# EAGLE schematic MDB1986 (EAGLE 9.0.0)
Milandr Development Board K1986BE1T (K1986BE1QI - LQFP144)
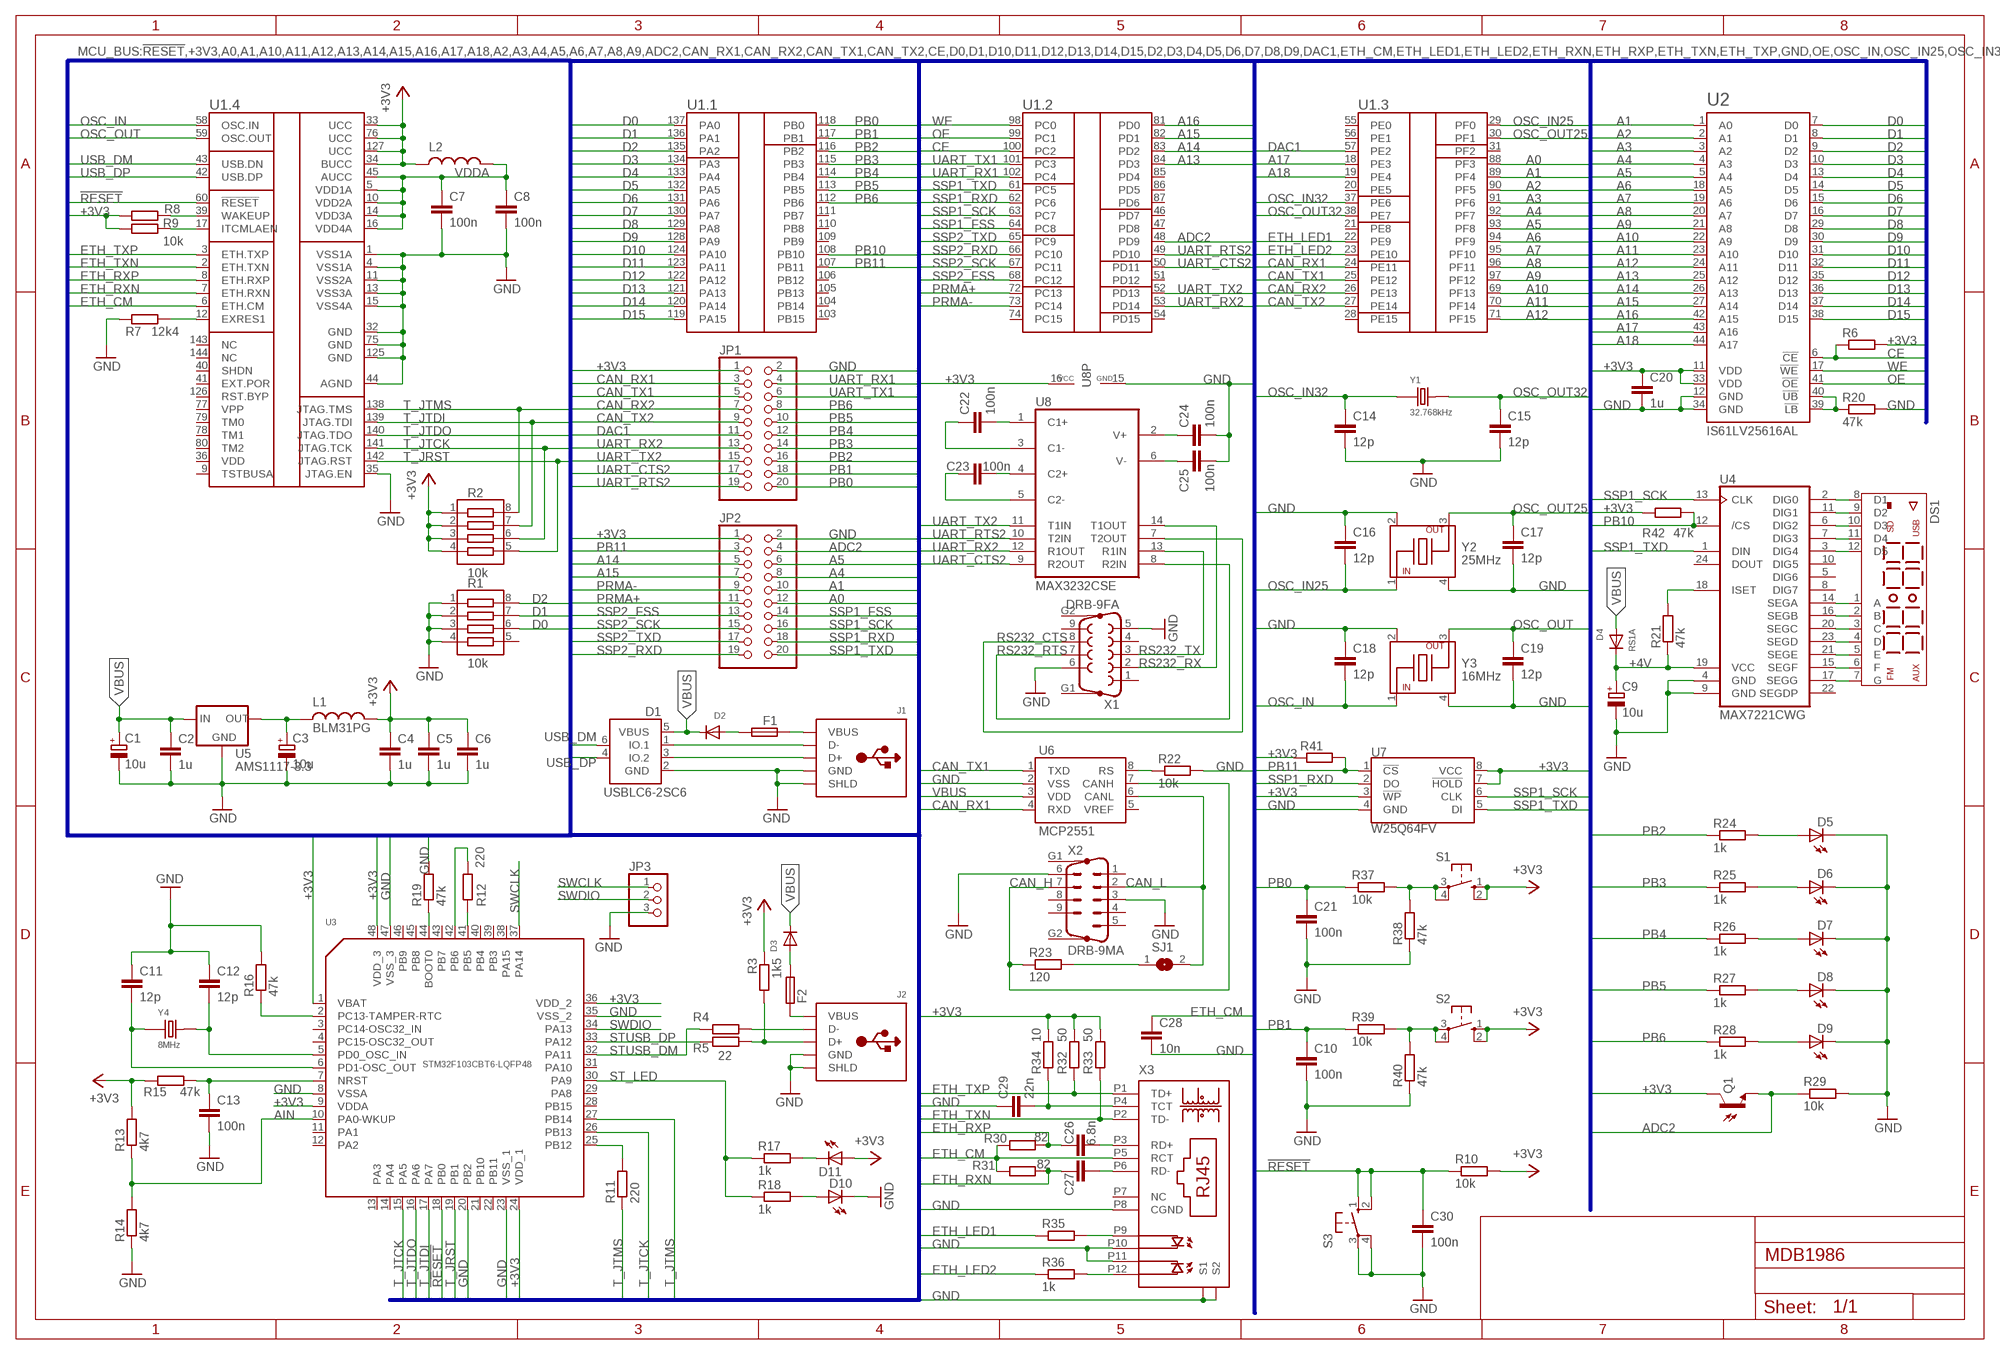
[diagram p0: schematic, sheet 1]

## Parts
C1  10u  CPOL-EU  [RCL-1206F-POL]
C2  1u  C-EU0805  [RCL-0805F]
C3  10u  CPOL-EU  [RCL-1206F-POL]
C4  1u  C-EU0805  [RCL-0805F]
C5  1u  C-EU0805  [RCL-0805F]
C6  1u  C-EU0805  [RCL-0805F]
C7  100n  C-EU0805  [RCL-0805F]
C8  100n  C-EU0805  [RCL-0805F]
C9  10u  CPOL-EU  [RCL-1206F-POL]
C10  100n  C-EU0805  [RCL-0805F]
C11  12p  C-EU0805  [RCL-0805F]
C12  12p  C-EU0805  [RCL-0805F]
C13  100n  C-EU0805  [RCL-0805F]
C14  12p  C-EU0805  [RCL-0805F]
C15  12p  C-EU0805  [RCL-0805F]
C16  12p  C-EU0805  [RCL-0805F]
C17  12p  C-EU0805  [RCL-0805F]
C18  12p  C-EU0805  [RCL-0805F]
C19  12p  C-EU0805  [RCL-0805F]
C20  1u  C-EU0805  [RCL-0805F]
C21  100n  C-EU0805  [RCL-0805F]
C22  100n  C-EU0805  [RCL-0805F]
C23  100n  C-EU0805  [RCL-0805F]
C24  100n  C-EU0805  [RCL-0805F]
C25  100n  C-EU0805  [RCL-0805F]
C26  6.8n  C-EU0805  [RCL-0805F]
C27  C-EU0805  [RCL-0805F]
C28  10n  C-EU0805  [RCL-0805F]
C29  22n  C-EU0805  [RCL-0805F]
C30  100n  C-EU0805  [RCL-0805F]
D1  USBLC6-2SC6  [SOT-23-6L]
D2  DIODEDO-214(SMB)  [DO-214AA(SMB)]
D3  DIODEDO-214(SMB)  [DO-214AA(SMB)]
D4  RS1A  DIODEDO-214(SMA)  [DO-214AC(SMA)]
D5  LED1206  [LED-1206F]
D6  LED1206  [LED-1206F]
D7  LED1206  [LED-1206F]
D8  LED1206  [LED-1206F]
D9  LED1206  [LED-1206F]
D10  LED1206  [LED-1206F]
D11  LED1206  [LED-1206F]
DS1  LED-7SEG-12PIN-CC  [LED-7SEG-12P2.54]
F1  FUSE-NSMF  [RCL-1206F]
F2  FUSE-NSMF  [RCL-1206F]
J1  USB-TYPE-B  [USB-TYPE-B-4P]
J2  USB-TYPE-B  [USB-TYPE-B-4P]
JP1  PINHD-2X10  [2X10]
JP2  PINHD-2X10  [2X10]
JP3  PINHD-1X3  [1X03]
L1  BLM31PG  L-EU1206  [RCL-1206F]
L2  L-EU1206  [RCL-1206F]
Q1  PHOTOTRANSISTORPT17-21C-L41-TR8  [PT17-21C-L41-TR8]
R1  10k  RA-CAT16-F4  [RA-1206-X4]
R2  10k  RA-CAT16-F4  [RA-1206-X4]
R3  1k5  R-EU0805  [RCL-0805F]
R4  R-EU0805  [RCL-0805F]
R5  22  R-EU0805  [RCL-0805F]
R6  R-EU0805  [RCL-0805F]
R7  12k4  R-EU0805  [RCL-0805F]
R8  R-EU0805  [RCL-0805F]
R9  10k  R-EU0805  [RCL-0805F]
R10  10k  R-EU0805  [RCL-0805F]
R11  220  R-EU0805  [RCL-0805F]
R12  220  R-EU0805  [RCL-0805F]
R13  4k7  R-EU0805  [RCL-0805F]
R14  4k7  R-EU0805  [RCL-0805F]
R15  47k  R-EU0805  [RCL-0805F]
R16  47k  R-EU0805  [RCL-0805F]
R17  1k  R-EU0805  [RCL-0805F]
R18  1k  R-EU0805  [RCL-0805F]
R19  47k  R-EU0805  [RCL-0805F]
R20  47k  R-EU0805  [RCL-0805F]
R21  47k  R-EU0805  [RCL-0805F]
R22  10k  R-EU0805  [RCL-0805F]
R23  120  R-EU0805  [RCL-0805F]
R24  1k  R-EU0805  [RCL-0805F]
R25  1k  R-EU0805  [RCL-0805F]
R26  1k  R-EU0805  [RCL-0805F]
R27  1k  R-EU0805  [RCL-0805F]
R28  1k  R-EU0805  [RCL-0805F]
R29  10k  R-EU0805  [RCL-0805F]
R30  82  R-EU0805  [RCL-0805F]
R31  82  R-EU0805  [RCL-0805F]
R32  50  R-EU0805  [RCL-0805F]
R33  50  R-EU0805  [RCL-0805F]
R34  10  R-EU0805  [RCL-0805F]
R35  R-EU0805  [RCL-0805F]
R36  1k  R-EU0805  [RCL-0805F]
R37  10k  R-EU0805  [RCL-0805F]
R38  47k  R-EU0805  [RCL-0805F]
R39  10k  R-EU0805  [RCL-0805F]
R40  47k  R-EU0805  [RCL-0805F]
R41  R-EU0805  [RCL-0805F]
R42  47k  R-EU0805  [RCL-0805F]
S1  SWITCH-10-XX  [BUTTON-B3F-10XX]
S2  SWITCH-10-XX  [BUTTON-B3F-10XX]
S3  SWITCH-10-XX  [BUTTON-B3F-10XX]
SJ1  SJ  [SJ]
U1  MCU-K1986BE1QI  [LQFP144-0.5-20X20M]
U2  IS61LV25616AL  [TSOP2-44-400BF]
U3  STM32F103CBT6-LQFP48  MCU-STM32F103CBT6  [LQFP48-0.5-7X7MM]
U4  MAX7221CWG  [SO24W]
U5  AMS1117-3.3  [SOT223]
U6  MCP2551  [SO08]
U7  W25Q64FV  W25Q64FVSS  [SOIC-8]
U8  MAX3232CSE  [SO16]
X1  DRB-9FA  F09HP  [F09HP]
X2  DRB-9MA  M09HP  [M09HP]
X3  HR911105A  [RJ45]
Y1  32.768kHz  CRYSTAL-FC-135  [XTAL-FC-135]
Y2  25MHz  CRYSTAL-FA-238  [XTAL-FA-238]
Y3  16MHz  CRYSTAL-FA-238  [XTAL-FA-238]
Y4  8MHz  CRYSTAL-NX3225  [XTAL-NX3225]

## Nets
!RESET: C30.1 R10.1 S3.1(S) S3.2(S1) U1.60(.4:!RESET) U3.18(PB0)
+3V3: C4.1 C5.1 C6.1 C20.1 D11.A JP1.1 JP2.1 L1.2 L2.1 Q1.C R2.1(P.1) R2.2(P.2) R2.3(P.3) R2.4(P.4) R3.1 R6.2 R8.1 R9.1 R10.2 R13.2 R15.1 R32.2 R33.2 R34.2 R41.1 R42.1 S1.1(S) S1.2(S1) S2.1(S) S2.2(S1) U1.33(.4:UCC) U1.34(.4:BUCC) U1.76(.4:UCC) U1.127(.4:UCC) U2.11(VDD) U2.33(VDD) U3.1(VBAT) U3.9(VDDA) U3.24(VDD_1) U3.36(VDD_2) U3.48(VDD_3) U7.3(!WP) U7.7(!HOLD) U7.8(VCC) U8.16(VCC)
+4V: C9.+ D4.C R21.1 U4.19(VCC)
A0: JP2.12 U1.88(.3:PF3)
A1: JP2.10 U1.89(.3:PF4) U2.1(A0)
A2: U1.90(.3:PF5) U2.2(A1)
A3: U1.91(.3:PF6) U2.3(A2)
A4: JP2.8 U1.92(.3:PF7) U2.4(A3)
A5: JP2.6 U1.93(.3:PF8) U2.5(A4)
A6: U1.94(.3:PF9) U2.18(A5)
A7: U1.95(.3:PF10) U2.19(A6)
A8: U1.96(.3:PF11) U2.20(A7)
A9: U1.97(.3:PF12) U2.21(A8)
A10: U1.69(.3:PF13) U2.22(A9)
A11: U1.70(.3:PF14) U2.23(A10)
A12: U1.71(.3:PF15) U2.24(A11)
A13: U1.84(.2:PD3) U2.25(A12)
A14: JP2.5 U1.83(.2:PD2) U2.26(A13)
A15: JP2.7 U1.82(.2:PD1) U2.27(A14)
A16: U1.81(.2:PD0) U2.42(A15)
A17: U1.18(.3:PE3) U2.43(A16)
A18: U1.19(.3:PE4) U2.44(A17)
ADC2: JP2.4 Q1.E R29.1 U1.48(.2:PD9)
AIN: R13.1 R14.2 U3.10(PA0-WKUP)
BOOT0: R19.1 U3.44(BOOT0)
CAN_H: R23.1 U6.7(CANH) X2.7
CAN_L: SJ1.2 U6.6(CANL) X2.2
CAN_RX1: JP1.3 U1.24(.3:PE11) U6.4(RXD)
CAN_RX2: JP1.7 U1.26(.3:PE13)
CAN_TX1: JP1.5 U1.25(.3:PE12) U6.1(TXD)
CAN_TX2: JP1.9 U1.27(.3:PE14)
CE: R6.1 U1.100(.2:PC2) U2.6(!CE)
D0: R1.6(P.6) U1.137(.1:PA0) U2.7(D0)
D1: R1.7(P.7) U1.136(.1:PA1) U2.8(D1)
D2: R1.8(P.8) U1.135(.1:PA2) U2.9(D2)
D3: U1.134(.1:PA3) U2.10(D3)
D4: U1.133(.1:PA4) U2.13(D4)
D5: U1.132(.1:PA5) U2.14(D5)
D6: U1.131(.1:PA6) U2.15(D6)
D7: U1.130(.1:PA7) U2.16(D7)
D8: U1.129(.1:PA8) U2.29(D8)
D9: U1.128(.1:PA9) U2.30(D9)
D10: U1.124(.1:PA10) U2.31(D10)
D11: U1.123(.1:PA11) U2.32(D11)
D12: U1.122(.1:PA12) U2.35(D12)
D13: U1.121(.1:PA13) U2.36(D13)
D14: U1.120(.1:PA14) U2.37(D14)
D15: U1.119(.1:PA15) U2.38(D15)
DAC1: JP1.11 U1.57(.3:PE2)
ETH_CM: C28.1 R30.1 R31.1 U1.6(.4:ETH.CM) X3.P5(RCT)
ETH_LED1: R35.1 U1.22(.3:PE9)
ETH_LED2: R36.1 U1.23(.3:PE10)
ETH_RXN: C27.1 R31.2 U1.7(.4:ETH.RXN)
ETH_RXP: C26.1 R30.2 U1.8(.4:ETH.RXP)
ETH_TXN: R33.1 U1.2(.4:ETH.TXN) X3.P2(TD-)
ETH_TXP: R32.1 U1.3(.4:ETH.TXP) X3.P1(TD+)
GND: C1.- C2.2 C3.- C4.2 C5.2 C6.2 C7.2 C8.2 C9.- C10.2 C11.1 C12.1 C13.2 C14.2 C15.2 C16.1 C17.2 C18.1 C19.2 C20.2 C21.2 C24.2 C25.2 C28.2 C29.1 C30.2 D1.2(GND) D5.C D6.C D7.C D8.C D9.C D10.C J1.4_GND(GND) J1.M1(SHLD) J1.M2(SHLD) J2.4_GND(GND) J2.M1(SHLD) J2.M2(SHLD) JP1.2 JP2.2 JP3.3 R1.1(P.1) R1.2(P.2) R1.3(P.3) R1.4(P.4) R7.1 R14.1 R16.2 R19.2 R20.2 R22.2 R29.2 R38.1 R40.1 S3.3(P) S3.4(P1) U1.1(.4:VSS1A) U1.4(.4:VSS1A) U1.11(.4:VSS2A) U1.13(.4:VSS3A) U1.15(.4:VSS4A) U1.32(.4:GND) U1.35(.4:JTAG.EN) U1.44(.4:AGND) U1.75(.4:GND) U1.125(.4:GND) U2.12(GND) U2.34(GND) U3.8(VSSA) U3.20(PB2) U3.23(VSS_1) U3.35(VSS_2) U3.47(VSS_3) U4.4(GND) U4.9(GND) U5.1(GND) U6.2(VSS) U7.4(GND) U8.15(GND) X1.5 X1.6 X2.3 X2.6 X3.P8(CGND) X3.P10(GLED-) X3.P11(YLED-) X3.SHIELD1(S1) X3.SHIELD2(S2) Y2.2 Y2.4 Y3.2 Y3.4
N$1: DS1.8(D1) U4.2(DIG0)
N$2: DS1.9(D2) U4.11(DIG1)
N$3: DS1.10(D3) U4.6(DIG2)
N$4: DS1.11(D4) U4.7(DIG3)
N$6: DS1.12(D5) U4.3(DIG4)
N$7: DS1.1(A) U4.14(SEGA)
N$8: DS1.2(B) U4.16(SEGB)
N$9: DS1.3(C) U4.20(SEGC)
N$10: DS1.4(D) U4.23(SEGD)
N$11: DS1.5(E) U4.21(SEGE)
N$12: DS1.6(F) U4.15(SEGF)
N$13: DS1.7(G) U4.17(SEGG)
N$14: F1.1 J1.1_VBUS(VBUS)
N$15: D2.A F1.2
N$16: C12.2 U3.5(PD0_OSC_IN) Y4.2
N$17: C11.2 U3.6(PD1-OSC_OUT) Y4.1
N$18: R21.2 U4.18(ISET)
N$19: D10.A R18.2
N$20: R12.1 U3.41(PB5)
N$21: R12.2 U3.42(PB6)
N$22: C3.+ L1.1 U5.2(OUT) U5.4(OUT)
N$23: R11.2 U3.25(PB12)
N$24: D11.C R17.2
N$25: J2.2_DM(D-) R4.1
N$26: J2.3_DP(D+) R3.2 R5.1
N$27: C22.2 U8.1(C1+)
N$28: F2.1 J2.1_VBUS(VBUS)
N$29: C13.1 R15.2 U3.7(NRST)
N$30: R8.2 U1.39(.4:WAKEUP)
N$31: R9.2 U1.17(.4:ITCMLAEN)
N$32: C22.1 U8.3(C1-)
N$34: R16.1 U3.2(PC13-TAMPER-RTC)
N$35: C23.2 U8.4(C2+)
N$36: C23.1 U8.5(C2-)
N$37: C25.1 U8.6(V-)
N$38: C24.1 U8.2(V+)
N$39: R20.1 U2.39(!LB) U2.40(!UB)
N$41: R7.2 U1.12(.4:EXRES1)
N$42: R23.2 SJ1.1
N$45: R22.1 U6.8(RS)
N$46: D3.A F2.2
N$47: D9.A R28.2
N$48: D8.A R27.2
N$49: D7.A R26.2
N$50: R37.2 R38.2 S1.3(P) S1.4(P1)
N$51: D6.A R25.2
N$52: D5.A R24.2
N$54: C29.2 R34.1 X3.P4(TCT)
N$55: R36.2 X3.P12(YLED+)
N$56: R35.2 X3.P9(GLED+)
N$57: C27.2 X3.P6(RD-)
N$58: C26.2 X3.P3(RD+)
N$61: R39.2 R40.2 S2.3(P) S2.4(P1)
OE: U1.99(.2:PC1) U2.41(!OE)
OSC_IN: C18.2 U1.58(.4:OSC.IN) Y3.1(X.IN)
OSC_IN25: C16.2 U1.29(.3:PF0) Y2.1(X.IN)
OSC_IN32: C14.1 U1.37(.3:PE6) Y1.1
OSC_OUT: C19.1 U1.59(.4:OSC.OUT) Y3.3(X.OUT)
OSC_OUT25: C17.1 U1.30(.3:PF1) Y2.3(X.OUT)
OSC_OUT32: C15.1 U1.38(.3:PE7) Y1.2
PB0: C21.1 JP1.20 R37.1 U1.118(.1:PB0)
PB1: C10.1 JP1.18 R39.1 U1.117(.1:PB1)
PB2: JP1.16 R24.1 U1.116(.1:PB2)
PB3: JP1.14 R25.1 U1.115(.1:PB3)
PB4: JP1.12 R26.1 U1.114(.1:PB4)
PB5: JP1.10 R27.1 U1.113(.1:PB5)
PB6: JP1.8 R28.1 U1.112(.1:PB6)
PB10: R42.2 U1.108(.1:PB10) U4.12(/CS)
PB11: JP2.3 R41.2 U1.107(.1:PB11) U7.1(!CS)
PRMA+: JP2.11 U1.72(.2:PC13)
PRMA-: JP2.9 U1.73(.2:PC14)
RS232_CTS: U8.7(T2OUT) X1.8
RS232_RTS: U8.8(R2IN) X1.7
RS232_RX: U8.14(T1OUT) X1.2
RS232_TX: U8.13(R1IN) X1.3
SSP1_FSS: JP2.14 U1.64(.2:PC8)
SSP1_RXD: JP2.18 U1.62(.2:PC6) U7.2(DO)
SSP1_SCK: JP2.16 U1.63(.2:PC7) U4.13(CLK) U7.6(CLK)
SSP1_TXD: JP2.20 U1.61(.2:PC5) U4.1(DIN) U7.5(DI)
SSP2_FSS: JP2.13 U1.68(.2:PC12)
SSP2_RXD: JP2.19 U1.66(.2:PC10)
SSP2_SCK: JP2.15 U1.67(.2:PC11)
SSP2_TXD: JP2.17 U1.65(.2:PC9)
ST_LED: R17.1 R18.1 U3.30(PA9)
STUSB_DM: R4.2 U3.32(PA11)
STUSB_DP: R5.2 U3.33(PA12)
SWCLK: JP3.1 U3.37(PA14)
SWDIO: JP3.2 U3.34(PA13)
T_JRST: R2.5(P.5) U1.142(.4:JTAG.RST) U3.19(PB1)
T_JTCK: R2.6(P.6) U1.141(.4:JTAG.TCK) U3.15(PA5) U3.26(PB13)
T_JTDI: R2.7(P.7) U1.139(.4:JTAG.TDI) U3.17(PA7)
T_JTDO: U1.140(.4:JTAG.TDO) U3.16(PA6)
T_JTMS: R2.8(P.8) R11.1 U1.138(.4:JTAG.TMS) U3.27(PB14)
UART_CTS2: JP1.17 U1.50(.2:PD11) U8.9(R2OUT)
UART_RTS2: JP1.19 U1.49(.2:PD10) U8.10(T2IN)
UART_RX1: JP1.4 U1.102(.2:PC4)
UART_RX2: JP1.13 U1.53(.2:PD14) U8.12(R1OUT)
UART_TX1: JP1.6 U1.101(.2:PC3)
UART_TX2: JP1.15 U1.52(.2:PD13) U8.11(T1IN)
USB_D+: D1.3(IO.2) J1.3_DP(D+)
USB_D-: D1.1(IO.1) J1.2_DM(D-)
USB_DM: D1.6(IO_1) U1.43(.4:USB.DN)
USB_DP: D1.4(IO_2) U1.42(.4:USB.DP)
VBUS: C1.+ C2.1 D1.5(VBUS) D2.C D3.C D4.A U5.3(IN) U6.3(VDD)
VDDA: C7.1 C8.1 L2.2 U1.5(.4:VDD1A) U1.10(.4:VDD2A) U1.14(.4:VDD3A) U1.16(.4:VDD4A) U1.45(.4:AUCC)
WE: U1.98(.2:PC0) U2.17(!WE)
Unconnected: R1.5(P.5) U1.9(.4:TSTBUSA) U1.20(.3:PE5) U1.21(.3:PE8) U1.28(.3:PE15) U1.31(.3:PF2) U1.36(.4:VDD) U1.40(.4:SHDN) U1.41(.4:EXT.POR) U1.46(.2:PD7) U1.47(.2:PD8) U1.51(.2:PD12) U1.54(.2:PD15) U1.55(.3:PE0) U1.56(.3:PE1) U1.74(.2:PC15) U1.77(.4:VPP) U1.78(.4:TM1) U1.79(.4:TM0) U1.80(.4:TM2) U1.85(.2:PD4) U1.86(.2:PD5) U1.87(.2:PD6) U1.103(.1:PB15) U1.104(.1:PB14) U1.105(.1:PB13) U1.106(.1:PB12) U1.109(.1:PB9) U1.110(.1:PB8) U1.111(.1:PB7) U1.126(.4:RST.BYP) U1.143(.4:NC) U1.144(.4:NC) U3.3(PC14-OSC32_IN) U3.4(PC15-OSC32_OUT) U3.11(PA1) U3.12(PA2) U3.13(PA3) U3.14(PA4) U3.21(PB10) U3.22(PB11) U3.28(PB15) U3.29(PA8) U3.31(PA10) U3.38(PA15) U3.39(PB3) U3.40(PB4) U3.43(PB7) U3.45(PB8) U3.46(PB9) U4.5(DIG6) U4.8(DIG7) U4.10(DIG5) U4.22(SEGDP) U4.24(DOUT) U6.5(VREF) X1.1 X1.4 X1.9 X1.G1 X1.G2 X2.1 X2.4 X2.5 X2.8 X2.9 X2.G1 X2.G2 X3.P7(NC)

## Buses
MCU_BUS:!RESET,+3V3,A0,A1,A10,A11,A12,A13,A14,A15,A16,A17,A18,A2,A3,A4,A5,A6,A7,A8,A9,ADC2,CAN_RX1,CAN_RX2,CAN_TX1,CAN_TX2,CE,D0,D1,D10,D11,D12,D13,D14,D15,D2,D3,D4,D5,D6,D7,D8,D9,DAC1,ETH_CM,ETH_LED1,ETH_LED2,ETH_RXN,ETH_RXP,ETH_TXN,ETH_TXP,GND,OE,OSC_IN,OSC_IN25,OSC_IN32,OSC_OUT,OSC_OUT25,OSC_OUT32,PB0,PB1,PB10,PB11,PB12,PB13,PB14,PB15,PB2,PB3,PB4,PB5,PB6,PB7,PB8,PB9,PRMA+,PRMA-,SSP1_FSS,SSP1_RXD,SSP1_SCK,SSP1_TXD,SSP2_FSS,SSP2_RXD,SSP2_SCK,SSP2_TXD,T_JRST,T_JTCK,T_JTDI,T_JTDO,T_JTMS,UART_CTS2,UART_RTS2,UART_RX1,UART_RX2,UART_TX1,UART_TX2,USB_DM,USB_DP,WE

## Library data of the parts
C1 C3 C9 = MakBit:CPOL-EU: Polarized capacitor Tantalum SMD 3215, Electrolytic D: 5mm (10uF 50V), 6mm (100uF 9V), 7mm, 10mm (10uF 400V), 13mm (22uF 400V)
C2 C4-C8 C10-C30 = MakBit:C-EU: SMD Capacitor
D1 = MakBit:USBLC6-2SC6: VERY LOW CAPACITANCE ESD PROTECTION 2 line 2 data-line protection Protects VBUS Very low capacitance: 3.5 pF max. Very low leakage current: 150 nA max Datasheet link <http://www.st.com/web/catalog/sense_power/FM114/CL1137/SC1489/PF93353>
D2-D4 = MakBit:DIODE: Diodes 1N4001 (DO-41 / DO-204AL) 1N4148, BZX55C (DO-35) 1N5400 (DO-201) RS1D (DO-214AC SMA) SS26 (DO-214AA SMB) MBR0520 (SOD-123) BAT54J (SOD-323)
D5-D11 = MakBit:LED: LEDs Standard schematic elements and footprints for 5mm, 3mm, 1206 LEDs.
DS1 = MakBit:LED-7SEG-12PIN-CC: Multimdeia 7-segment LED display (4 digits + symbols). 12 pin in a row Common Cathode
F1 F2 = MakBit:FUSE-NSMF: Bourns MF-NSMF Series - PRC Resettable Fuses USB port protection - USB 2.0, 3.0 HDMI 1.4 Source protection PC motherboards - Plug and Play protection Mobile phones - Battery and port protection PDAs / digital cameras
J1 J2 = MakBit:USB-TYPE-B: USB Type-B Connector 4 Pins
JP1 JP2 = pinhead:PINHD-2X10: PIN HEADER
JP3 = pinhead:PINHD-1X3: PIN HEADER
L1 L2 = MakBit:L-EU: Inductor SMD 0603 0805 1206 Through hole 9 x 12 mm
Q1 = MakBit:PHOTOTRANSISTOR: Phototransistor PT17-21C/L41/TR8 is a phototransistor in miniature SMD package which is molded in a water clear with flat top view lens. The device is spectrally matched to visible and infrared emitting diode. Datasheet <http://www.everlight.com/file/ProductFile/PT17-21C-L41-TR8.pdf>
R1 R2 = MakBit:RA-CAT16-F4: CAT16-F4
R3-R42 = MakBit:R-EU: SMD Resistor
S1-S3 = MakBit:SWITCH-10-XX: OMRON SWITCH; MPN: B3F-1000; OC_FARNELL: 176432; OC_NEWARK: 36M3542
SJ1 = jumper:SJ: SMD solder JUMPER
U1 = MakBit:MCU-K1986BE1QI: Milandr K1986BE1QI LQFP-144 Cortex-M1 MCU
U2 = MakBit:IS61LV25616AL: ISSI IS61LV25616AL CMOS SRAM 256K x 16 HIGH SPEED ASYNCHRONOUS CMOS STATIC RAM WITH 3.3V SUPPLY. High-speed access time: 10,12 TTL Compatible Inputs and Outputs No Clock or Refresh required Single 3.3V Supply
U3 = MakBit:MCU-STM32F103CBT6: 310010004; MPN: STM32F103CBT6; VALUE: STM32F103CBT6-LQFP48
U4 = MakBit:MAX7221CWG: MAX7219/MAX7221 - Serially Interfaced, 8-Digit LED Display Drivers 10MHz Serial Interface Individual LED Segment Control 150µA Low-Power Shutdown (Data Retained) Digital and Analog Brightness Control Drive Common-Cathode LED Display SPI, QSPI, MICROWIRE Serial Interface (MAX7221)
U5 = MakBit:AMS1117-3.3: 1A Low Dropout Voltage Regulator
U6 = MakBit:MCP2551: MCP2551 High Speed CAN Transceiver High speed CAN transceiver; PROD_ID: IC-09907
U7 = MakBit:W25Q64FVSS: W25Q64FVSS - SPI Flash in SOIC-8 (208 mil, i.e. 5.3mm) package.
U8 = maxim:MAX3232*: True RS-232 Transceivers 3.0V to 5.5V, Low-Power up to 1Mbps, Using Four 0.1µF External Capacitors Source: http://pdfserv.maxim-ic.com/en/ds/MAX3222-MAX3241.pdf; MPN: MAX3232CSE; OC_FARNELL: 9725490; OC_NEWARK: 90C2890
X1 = con-subd:F09HP: SUB-D; OC_FARNELL: unknown; OC_NEWARK: unknown
X2 = con-subd:M09HP: SUB-D; OC_FARNELL: unknown; OC_NEWARK: unknown
X3 = MakBit:HR911105A: HanRun HR911105A Single Port RJ45 Connector with Integrated Magnetics and LED for 10/100Base-T NIC Applications
Y1 = MakBit:CRYSTAL-FC-135: FC-135 Seiko Epson Corp. Frequenscy range: 32.768 kHz to 100kHz External dimensions: 3.2 x 1.5 x 0.80 mm
Y2 Y3 = MakBit:CRYSTAL-FA-238: FA-238 Crystal Unit Frequency range: 12 MHz to 60 MHz 3.2 x 2.5 mm
Y4 = MakBit:CRYSTAL-NX3225: NX3225GD Compact and thin. (3.2 x 2.5 x 0.8mm) Compatible with low frequency range starting from 7.98 MHz.